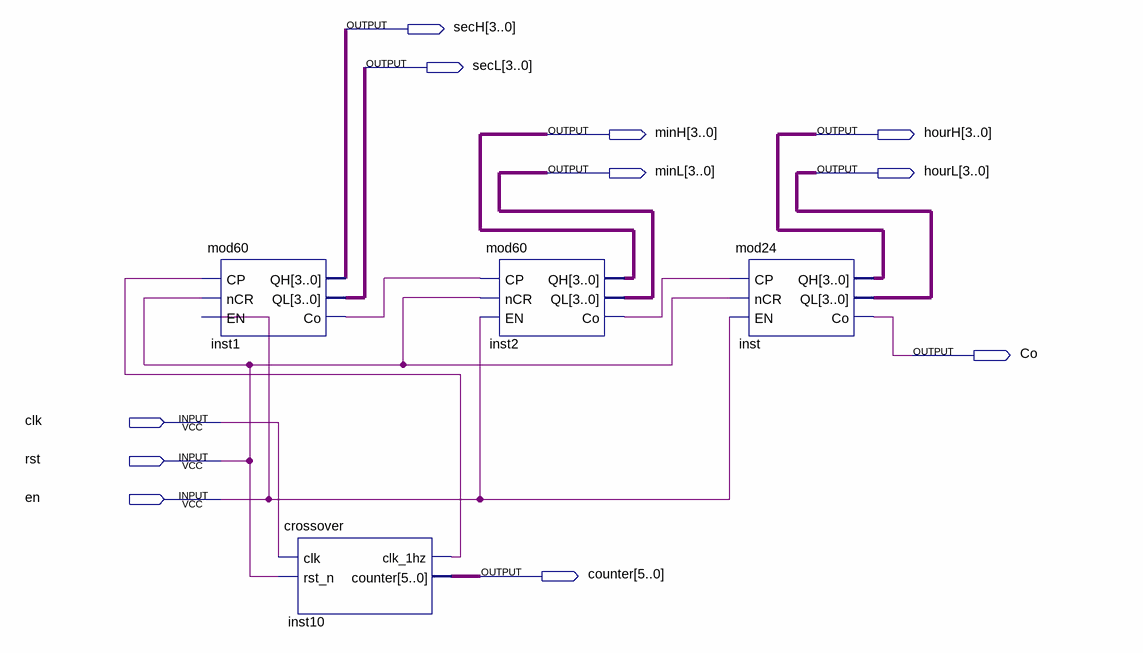
[diagram p0: schematic sheet]
// Quartus schematic clock.bdf as structural Verilog: 4 symbols, 11 pins
module clock (
  input  clk,
  input  rst,
  input  en,
  output [3:0] secH,
  output [3:0] secL,
  output [3:0] minH,
  output [3:0] hourH,
  output [3:0] minL,
  output [3:0] hourL,
  output Co,
  output [5:0] counter
);

  wire inst1_co, inst2_co, inst10_clk_1hz;

  mod60 inst1 (.CP(inst10_clk_1hz), .nCR(rst), .EN(en), .QH(secH), .QL(secL), .Co(inst1_co));
  crossover inst10 (.clk(clk), .rst_n(rst), .clk_1hz(inst10_clk_1hz), .counter(counter));
  mod60 inst2 (.CP(inst1_co), .nCR(rst), .EN(en), .QH(minH), .QL(minL), .Co(inst2_co));
  mod24 inst (.CP(inst2_co), .nCR(rst), .EN(en), .QH(hourH), .QL(hourL), .Co(Co));
endmodule
